# EAGLE design Crystal_lamp_Rev6 (EAGLE 9.6.2)
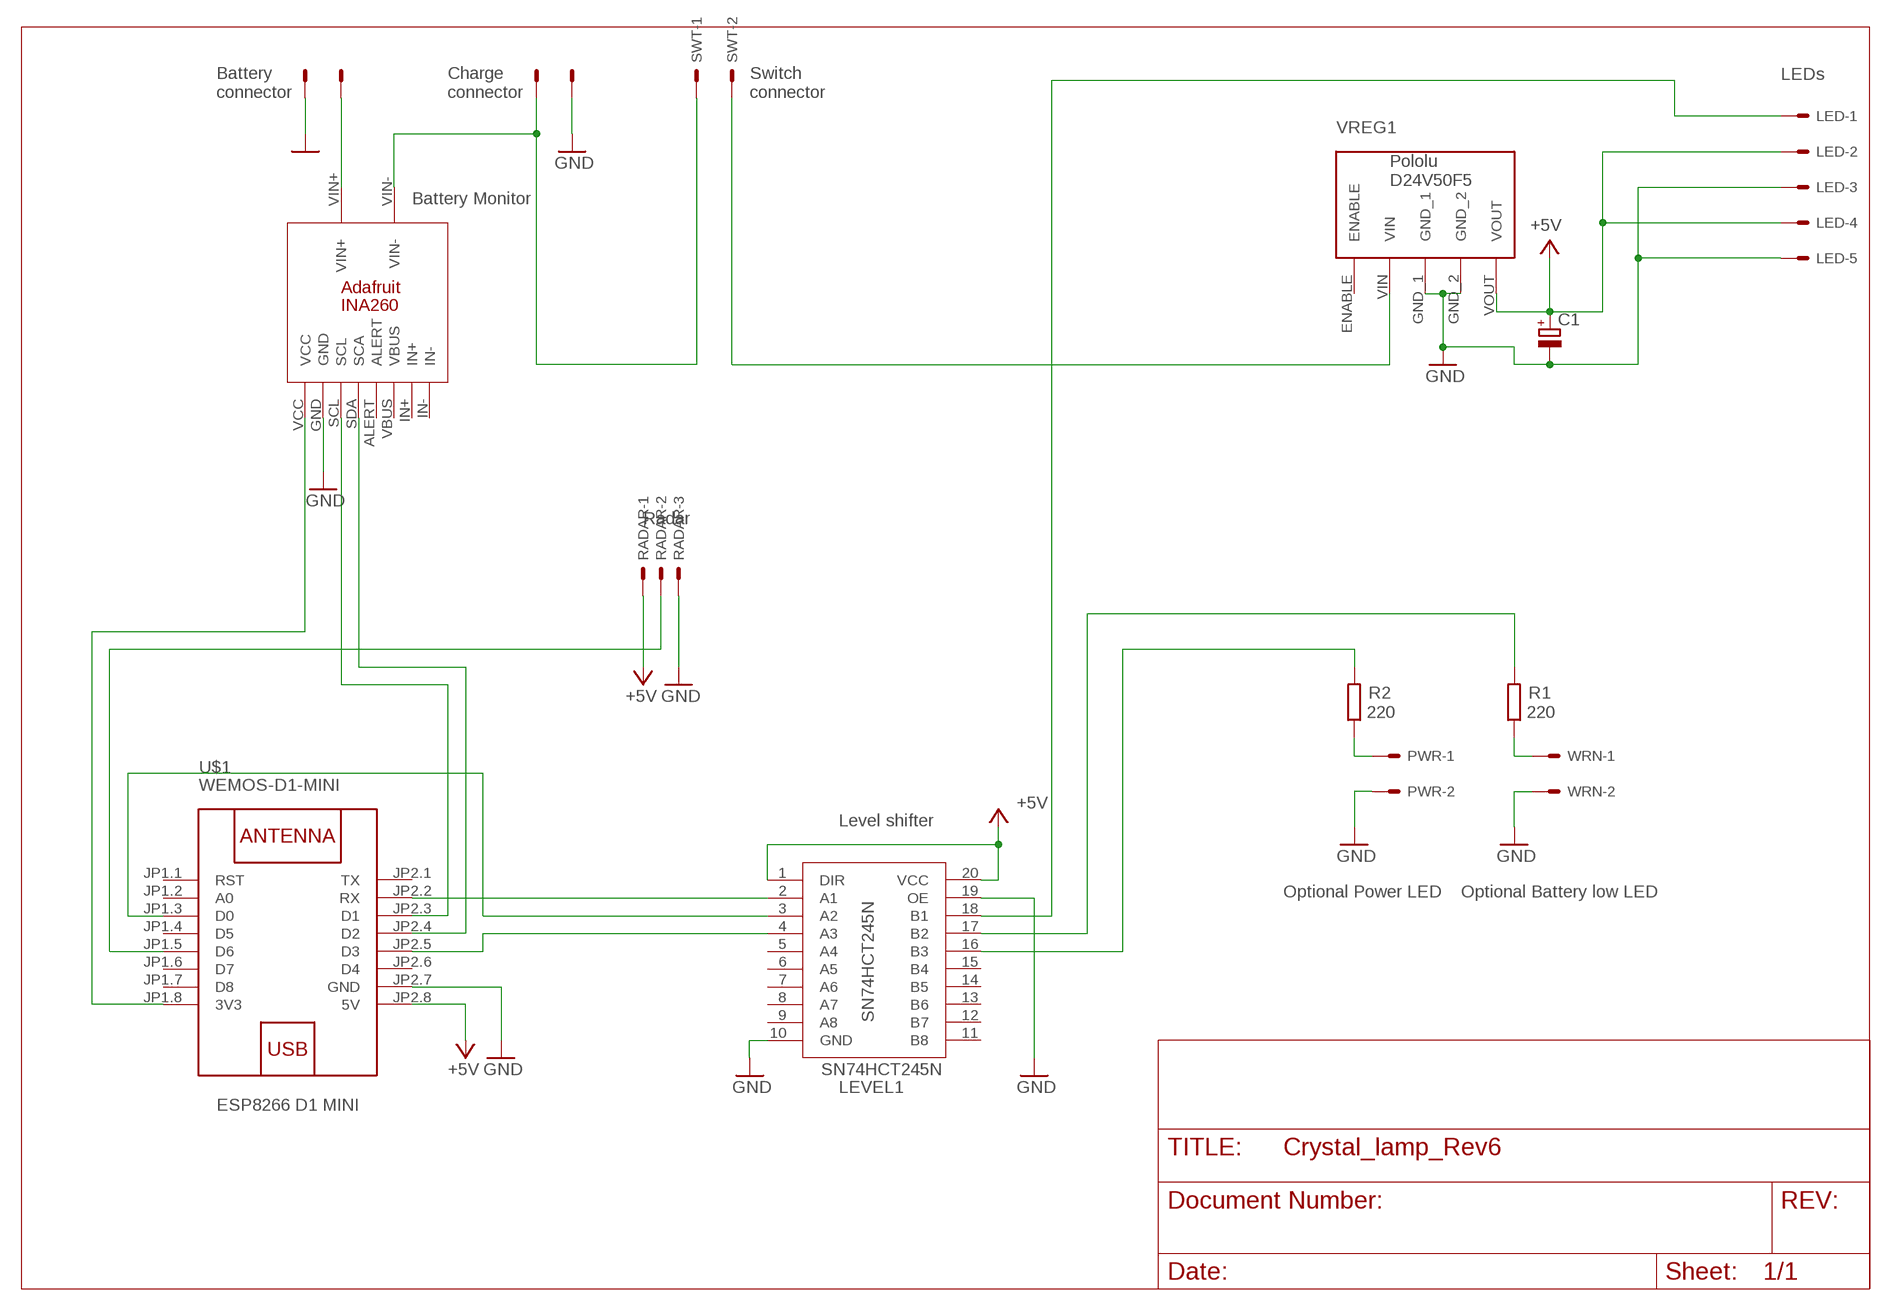
[diagram p0: schematic, sheet 1]

## Parts
BAT  22-27-2021-02  [6410-02]
C1  CPOL-EUE5-10.5  [E5-10,5]
CRG  22-27-2021-02  [6410-02]
INA1  INA260  [INA260]
LED  22-27-2051-05  [6410-05]
LEVEL1  SN74HCT245N  [DIL20]
PWR  22-27-2021-02  [6410-02]
R1  220  R-EU_0207/10  [0207/10]
R2  220  R-EU_0207/10  [0207/10]
RADAR  22-27-2031-03  [6410-03]
SWT  22-27-2021-02  [6410-02]
U$1  WEMOS-D1-MINI  [WEMOS-D1-MINI]
VREG1  D24V50F5  [D24V50F5]
WRN  22-27-2021-02  [6410-02]

## Nets
+5V: C1.+ LED.2 LED.4 LEVEL1.1(DIR) LEVEL1.20(VCC) RADAR.1 U$1.JP2.8(5V) VREG1.VOUT
GND: BAT.2 C1.- CRG.2 INA1.GND LED.3 LED.5 LEVEL1.10(GND) LEVEL1.19(OE) PWR.2 RADAR.3 U$1.JP2.7(GND) VREG1.GND_1 VREG1.GND_2 WRN.2
N$1: LEVEL1.4(A3) U$1.JP2.5(D3)
N$2: LEVEL1.3(A2) U$1.JP1.3(D0)
N$3: R1.1 WRN.1
N$4: LEVEL1.2(A1) U$1.JP2.2(RX)
N$5: BAT.1 INA1.VIN+
N$6: LED.1 LEVEL1.18(B1)
N$7: LEVEL1.17(B2) R1.2
N$8: LEVEL1.16(B3) R2.2
N$9: CRG.1 INA1.VIN- SWT.1
N$10: INA1.VCC U$1.JP1.8(3V3)
N$12: PWR.1 R2.1
N$13: RADAR.2 U$1.JP1.5(D6)
N$16: SWT.2 VREG1.VIN
SCL: INA1.SCL U$1.JP2.3(D1)
SDA: INA1.SDA(SCA) U$1.JP2.4(D2)
Unconnected: INA1.ALERT INA1.IN+ INA1.IN- INA1.VBUS LEVEL1.5(A4) LEVEL1.6(A5) LEVEL1.7(A6) LEVEL1.8(A7) LEVEL1.9(A8) LEVEL1.11(B8) LEVEL1.12(B7) LEVEL1.13(B6) LEVEL1.14(B5) LEVEL1.15(B4) U$1.JP1.1(RST) U$1.JP1.2(A0) U$1.JP1.4(D5) U$1.JP1.6(D7) U$1.JP1.7(D8) U$1.JP2.1(TX) U$1.JP2.6(D4) VREG1.ENABLE

## Notes on the sheet
- LEDs
- Battery 
  connector
- Charge 
  connector
- Switch
  connector
- Battery Monitor
- Radar
- Level shifter
- Optional Power LED | Optional Battery low LED
- ESP8266 D1 MINI

## Library data of the parts
BAT CRG PWR SWT WRN = con-molex:22-?-02: CONNECTOR wire to board 2.54 mm (.1 inch) pitch header; MF: MOLEX; OC_FARNELL: unknown; OC_NEWARK: unknown
C1 = rcl:CPOL-EU: POLARIZED CAPACITOR, European symbol; SPICEPREFIX: C
INA1 = Adafruit_Modules:INA260
LED = con-molex:22-?-05: CONNECTOR wire to board 2.54 mm (.1 inch) pitch header; MF: MOLEX; OC_FARNELL: unknown; OC_NEWARK: unknown
LEVEL1 = TI:SN74HCT245N
R1 R2 = rcl_update:R-EU_: RESISTOR, European symbol; SPICEPREFIX: R
RADAR = con-molex:22-?-03: CONNECTOR wire to board 2.54 mm (.1 inch) pitch header; MF: MOLEX; OC_FARNELL: unknown; OC_NEWARK: unknown
U$1 = diy-modules:WEMOS-D1-MINI: WEMOS D1 mini: Mini Wi-Fi Board based on ESP-8266 device More details can be found here: https://www.wemos.cc/product/d1-mini.html Click here to find device on ebay.com <http://www.ebay.com/sch/wemos+d1+mini+nodemcu>
VREG1 = Pololu:D24V50F5

## Board
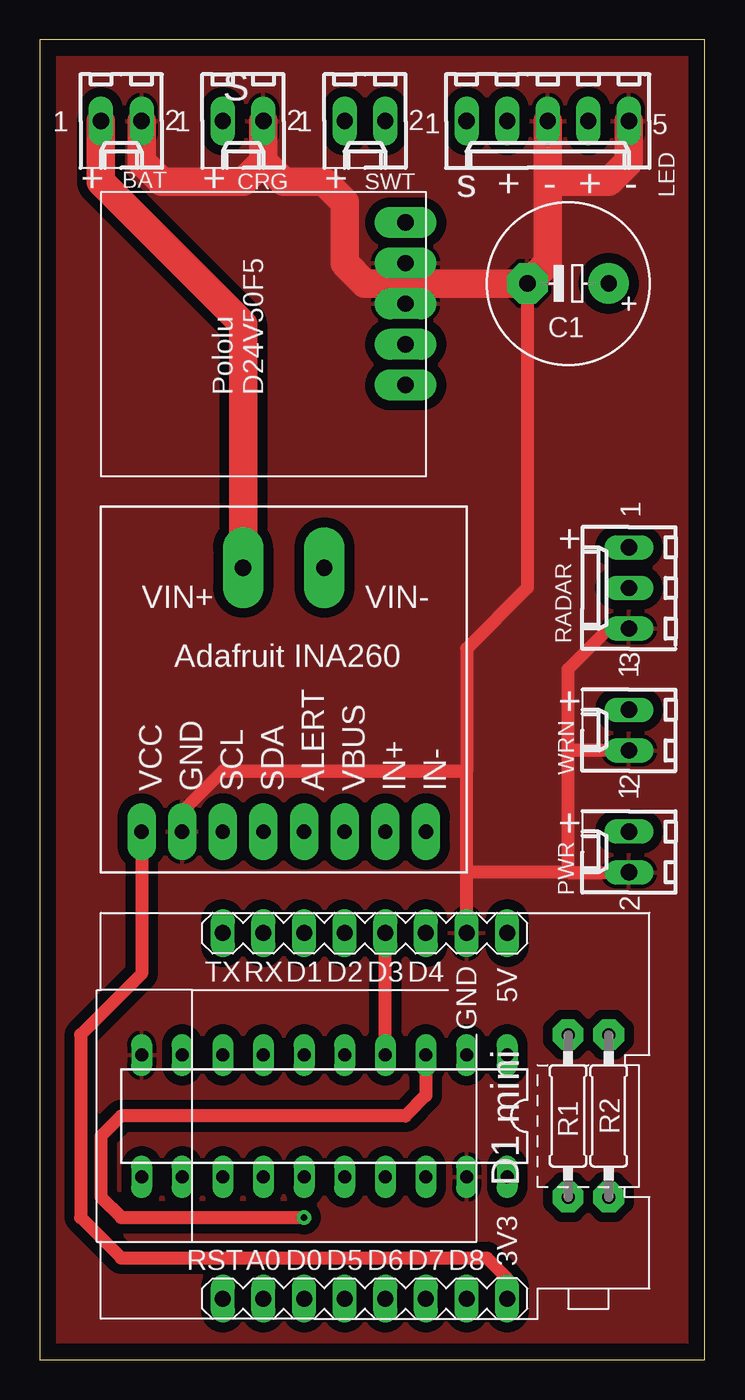
[diagram p1: board, top side]
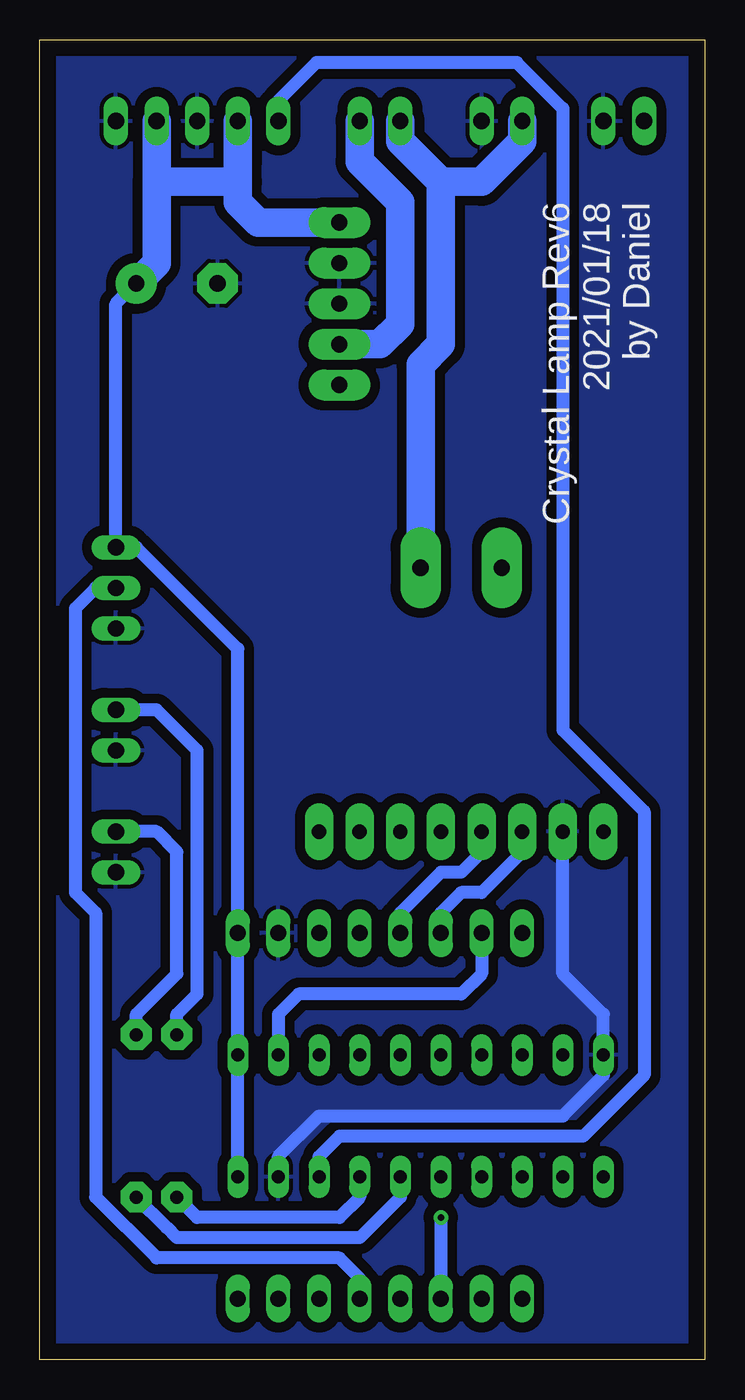
[diagram p2: board, bottom side, seen from below]

Size 41.58 x 82.54 mm. Coordinates in mm from the lower left corner, seen from the top.
Outline: 0,0 41.58,0 41.58,82.54 0,82.54 0,0
Copper layers (1*16): Top 0.035mm / dielectric 1.5mm / Bottom 0.035mm
Design rules "default": minimum track width 6mil, minimum drill 0.35mm, track to track 6mil, track to pad 6mil, pad to pad 6mil, via to via 6mil, smd to smd 6mil, copper to edge 40mil, drill to drill 6mil, minimum pad ring 10mil, minimum via ring 8mil, stop-mask expansion 4mil, vias tented up to drill 0mil, thermal gap 10mil

### Footprints (pad centres in the part's own frame; a part is rotated, then mirrored left to right if it is on the bottom)
6410-02 = drill 1.016 long: 1 1.27,0; 2 -1.27,0
E5-10,5 = drill 1.016 pad 2.54: + -2.54,0 | drill 1.016 pad 2.54 octagon: - 2.54,0
INA260 = drill 0.9 pad 1.778 long: ALERT 1.27,-8.89; GND -6.35,-8.89; IN+ 6.35,-8.89; IN- 8.89,-8.89; SCL -3.81,-8.89; SDA -1.27,-8.89; VBUS 3.81,-8.89; VCC -8.89,-8.89 | drill 1.016 pad 2.54 long: VIN+ -2.54,7.62; VIN- 2.54,7.62
6410-05 = drill 1.016 long: 1 5.08,0; 2 2.54,0; 3 0,0; 4 -2.54,0; 5 -5.08,0
DIL20 = drill 0.813 long: 1 -11.43,-3.81; 2 -8.89,-3.81; 3 -6.35,-3.81; 4 -3.81,-3.81; 5 -1.27,-3.81; 6 1.27,-3.81; 7 3.81,-3.81; 8 6.35,-3.81; 9 8.89,-3.81; 10 11.43,-3.81; 11 11.43,3.81; 12 8.89,3.81; 13 6.35,3.81; 14 3.81,3.81; 15 1.27,3.81; 16 -1.27,3.81; 17 -3.81,3.81; 18 -6.35,3.81; 19 -8.89,3.81; 20 -11.43,3.81
0207/10 = drill 0.813 pad 1.93 octagon: 1 -5.08,0; 2 5.08,0
6410-03 = drill 1.016 long: 1 2.54,0; 2 0,0; 3 -2.54,0
WEMOS-D1-MINI = drill 1 long: JP1.1 -11.43,9.525; JP1.2 -11.43,6.985; JP1.3 -11.43,4.445; JP1.4 -11.43,1.905; JP1.5 -11.43,-0.635; JP1.6 -11.43,-3.175; JP1.7 -11.43,-5.715; JP1.8 -11.43,-8.255; JP2.1 11.43,9.525; JP2.2 11.43,6.985; JP2.3 11.43,4.445; JP2.4 11.43,1.905; JP2.5 11.43,-0.635; JP2.6 11.43,-3.175; JP2.7 11.43,-5.715; JP2.8 11.43,-8.255
D24V50F5 = drill 1.016 pad 1.93 long: ENABLE 5.715,1.27; GND_1 10.795,1.27; GND_2 13.335,1.27; VIN 8.255,1.27; VOUT 15.875,1.27

### Placement (x,y rotation side)
BAT  5.08,77.47 180 top
C1  33.02,67.31 180 top
CRG  12.7,77.47 180 top
INA1  15.24,41.91 0 top
LED  31.75,77.47 180 top
LEVEL1  17.78,15.24 180 top
PWR  36.83,31.75 90 top
R1  33.02,15.24 270 top
R2  35.56,15.24 270 top
RADAR  36.83,48.26 90 top
SWT  20.32,77.47 180 top
U$1  20.95,15.24 90 top
VREG1  24.13,55.25 90 top
WRN  36.83,39.37 90 top

### Tracks (layer width: path | path; a pad name or v marks a point on that pad's centre or on a via)
+5V
  Bottom 0.813: LEVEL1.20 LEVEL1.1 U$1.JP2.8 29.21,44.45 35.56,50.8 RADAR.1 36.83,66.04 C1.+
  Bottom 1.778: C1.+ 34.29,68.58 34.29,73.66 | LED.4 34.29,73.66 | 29.21,74.93 LED.2 29.21,73.66 | VREG1.VOUT 27.94,71.12 29.21,72.39 29.21,73.66 | 34.29,73.66 29.21,73.66
GND
  Top 0.813: RADAR.3 35.56,45.72 33.02,43.18 33.02,38.1 | 33.02,30.48 PWR.2 | 33.02,30.48 33.02,38.1 | WRN.2 33.02,38.1 | C1.- 30.48,48.26 26.67,44.45 26.67,36.83 | INA1.GND 8.89,34.29 11.43,36.83 26.67,36.83 | U$1.JP2.7 26.67,30.48 | 26.67,30.48 26.67,36.83 | 33.02,30.48 26.67,30.48
  Top 1.778: VREG1.GND_1 22.86,67.31 | 22.86,67.31 C1.- 31.75,68.58 31.75,73.66 | 31.75,73.66 LED.3 | LED.5 36.83,74.93 35.56,73.66 31.75,73.66 | BAT.2 6.35,74.93 7.62,73.66 12.7,73.66 13.97,74.93 | VREG1.GND_2 22.86,67.31 | CRG.2 13.97,74.93 | 22.86,67.31 20.32,67.31 19.05,68.58 19.05,72.39 17.78,73.66 15.24,73.66 13.97,74.93
  Bottom 0.813: 8.89,34.29 INA1.GND 8.89,24.13 6.35,21.59 LEVEL1.10 6.35,17.78 8.89,15.24 24.13,15.24 26.67,12.7 LEVEL1.19
  pour Top (isolate 0.61): 0,82.55 41.91,82.55 41.91,0 0,0
  pour Bottom (isolate 0.61): 0,82.55 41.91,82.55 41.91,0 0,0
N$1
  Top 0.813: LEVEL1.4 U$1.JP2.5
N$2  (via drill 0.4 pad 0.9)
  Top 0.813: LEVEL1.3 24.13,16.51 22.86,15.24 5.08,15.24 3.81,13.97 3.81,10.16 5.08,8.89 v16.51,8.89
  Bottom 0.813: v16.51,8.89 U$1.JP1.3
N$3
  Bottom 0.813: R1.1 33.02,21.59 31.75,22.86 31.75,38.1 34.29,40.64 WRN.1
N$4
  Bottom 0.813: U$1.JP2.2 13.97,24.13 15.24,22.86 25.4,22.86 26.67,21.59 LEVEL1.2
N$5
  Top 1.778: BAT.1 3.81,73.66 12.7,64.77 INA1.VIN+
N$6
  Bottom 0.813: LEVEL1.18 24.13,12.7 22.86,13.97 7.62,13.97 3.81,17.78 3.81,34.29 8.89,39.37 8.89,78.25 11.76,81.12 24.29,81.12 26.67,78.74 LED.1
N$7
  Bottom 0.813: LEVEL1.17 21.59,10.16 22.86,8.89 31.75,8.89 R1.2
N$8
  Bottom 0.813: LEVEL1.16 19.05,10.16 21.59,7.62 33.02,7.62 33.66,8.26 R2.2
N$9
  Bottom 1.778: SWT.1 19.05,76.2 16.51,73.66 | 16.51,73.66 16.51,63.5 17.78,62.23 INA1.VIN- | 16.51,73.66 13.97,73.66 11.43,76.2 CRG.1
N$10
  Top 0.813: INA1.VCC 6.35,24.13 2.54,20.32 2.54,8.89 5.08,6.35 27.94,6.35 29.21,5.08 U$1.JP1.8
N$12
  Bottom 0.813: R2.1 35.56,21.59 33.02,24.13 33.02,31.75 34.29,33.02 PWR.1
N$13
  Bottom 0.813: U$1.JP1.5 21.59,5.08 22.86,6.35 34.29,6.35 38.1,10.16 38.1,27.94 39.37,29.21 39.37,46.99 38.1,48.26 RADAR.2
N$16
  Bottom 1.778: SWT.2 21.59,74.93 19.05,72.39 19.05,64.77 20.32,63.5 VREG1.VIN
SCL
  Bottom 0.813: U$1.JP2.3 16.51,27.94 15.24,29.21 13.97,29.21 11.43,31.75 INA1.SCL
SDA
  Bottom 0.813: INA1.SDA 13.97,31.75 15.24,30.48 16.51,30.48 19.05,27.94 U$1.JP2.4

### Text on the board
tPlace: S
tNames: + | + | + | s | + | - | + | - | + | + | +
bNames: Crystal Lamp Rev6 / 2021/01/18 / by Daniel